# Altium schematic sheet MINI-STM32.SchDoc
size A3
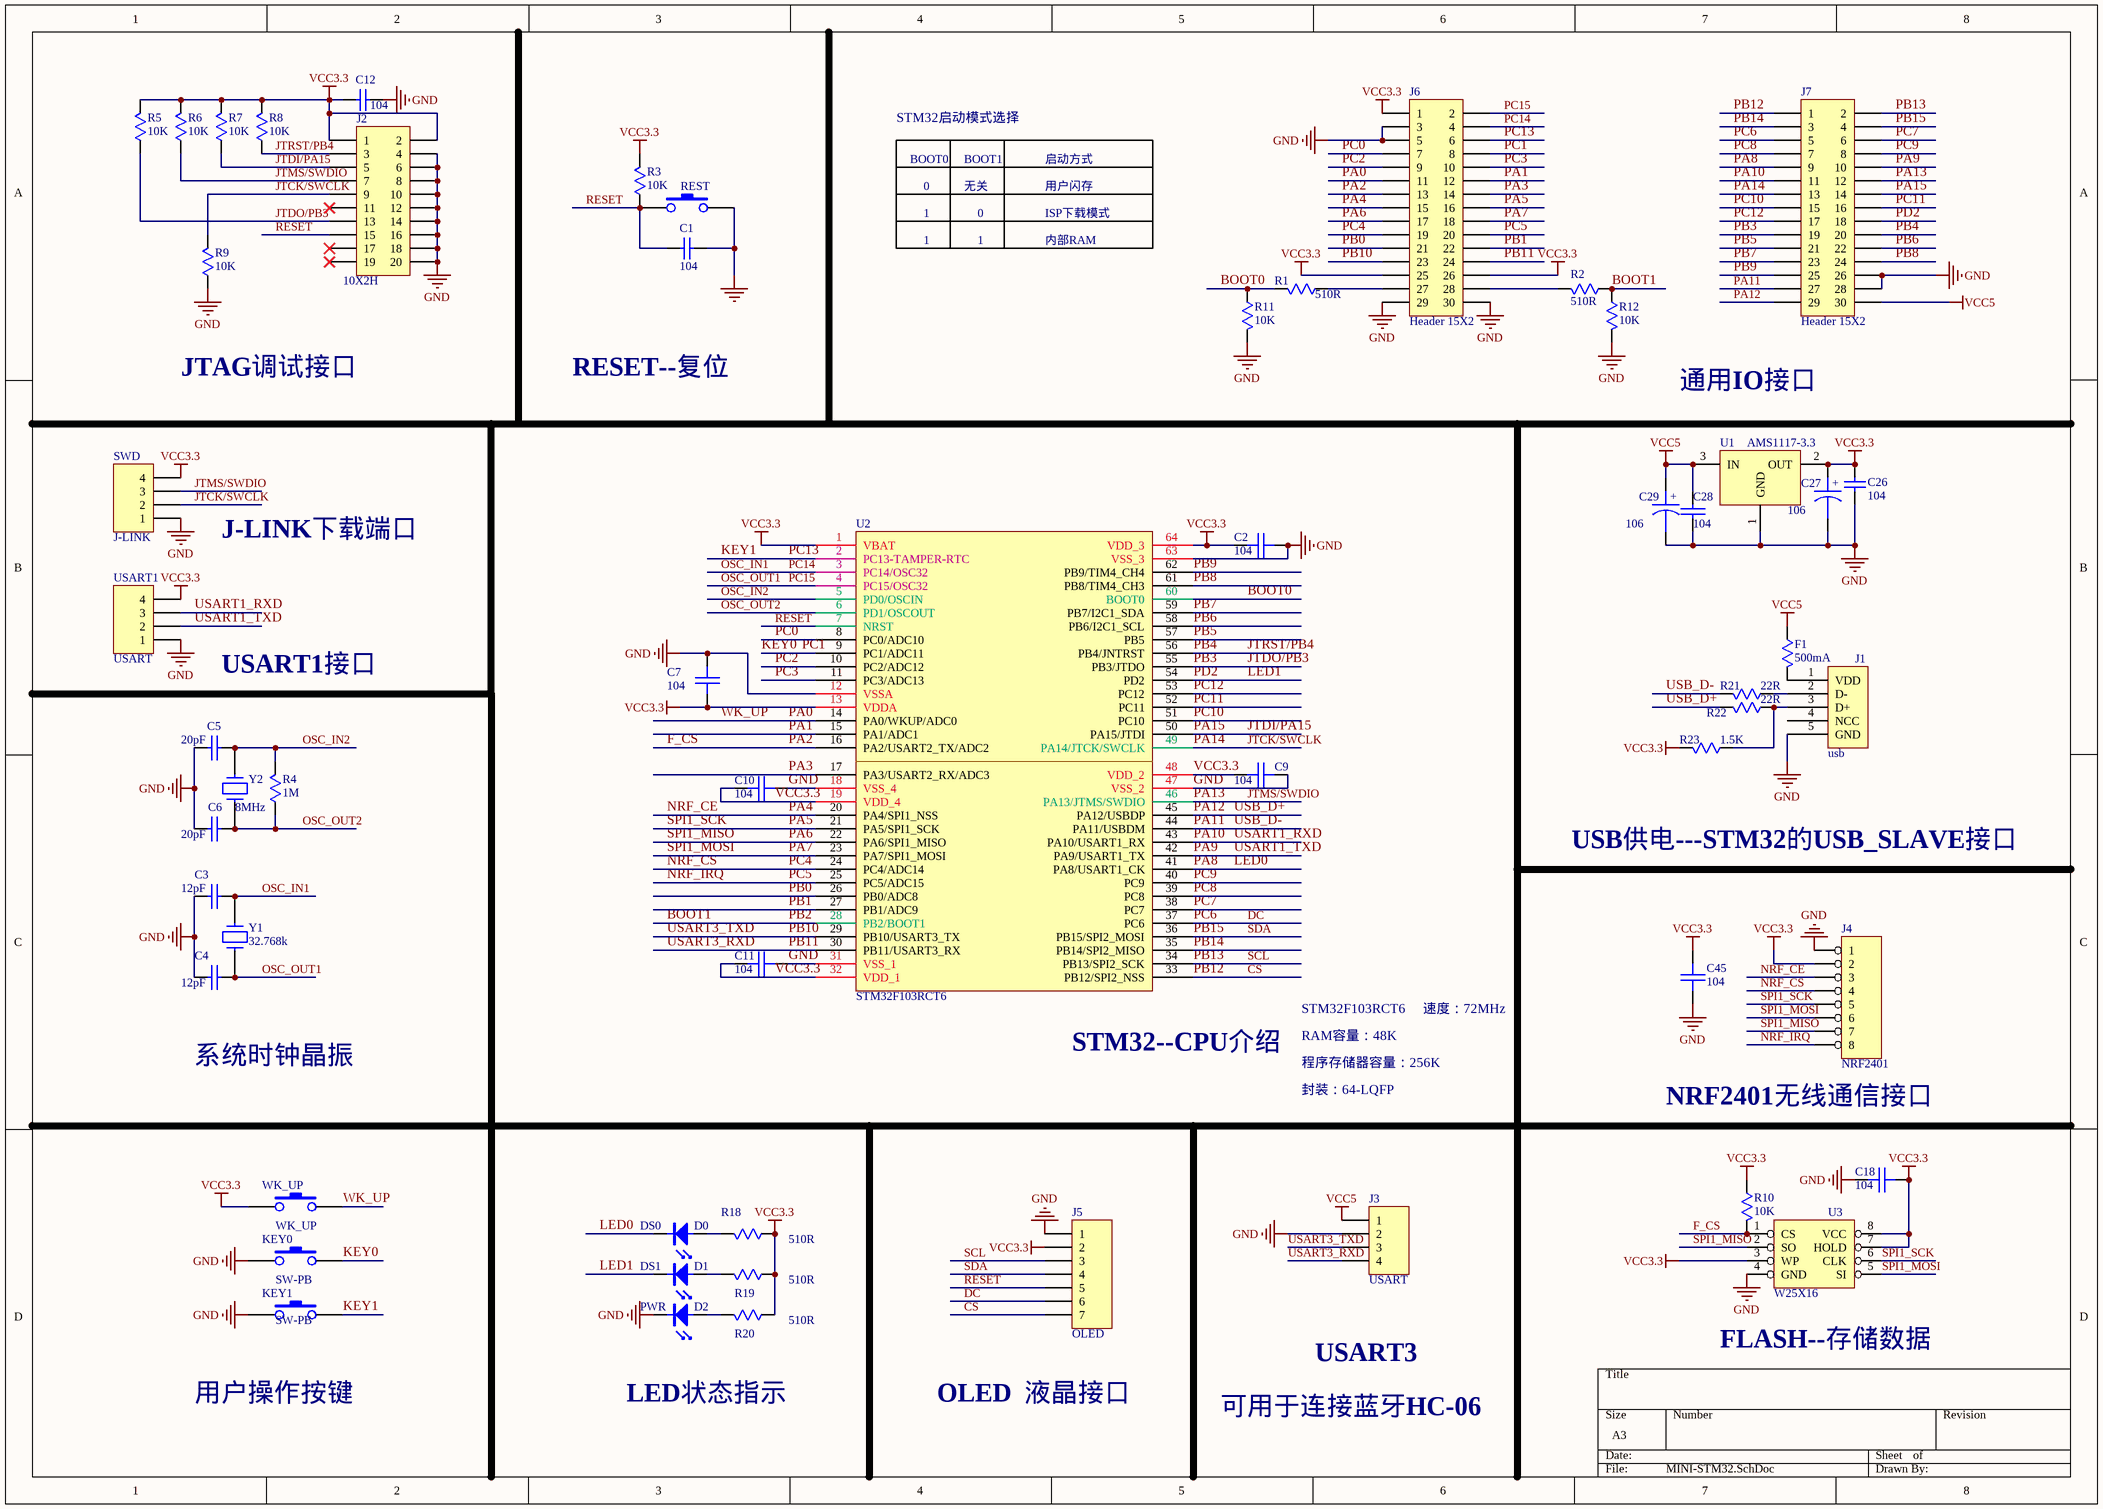
[diagram p0: MINI-STM32.SchDoc]

## Parts
C1  104  [0603C]
C2  104  [0603J]
C3  12pF  [0603J]
C4  12pF  [0603J]
C5  20pF  [0603J]
C6  20pF  [0603J]
C7  104  [0603J]
C9  104  [0603J]
C10  104  [0603J]
C11  104  [0603J]
C12  104  [0603C]
C18  104  [0603J]
C26  104  [0603J]
C27  106  [TAC_3216]
C28  104  [0603J]
C29  106  [TAC_3216]
C45  104  [0603J]
D0  DS0  [LED_0603(B)]
D1  DS1  [LED_0603(B)]
D2  PWR  [LED_0603(B)]
F1  500mA  [RC0805]
J1  usb  [mini_USB]
J2  10X2H  [IDC20]
J3  USART  [HDR1X4]
J4  NRF2401  [HDR2X4]
J5  OLED  [HDR1X7]
J6  Header 15X2  [IDE15X2_2.54]
J7  Header 15X2  [IDE15X2_2.54]
KEY0  SW-PB  [micro button_2_SMD]
KEY1  SW-PB  [micro button_2_SMD]
R1  510R  [0603J]
R2  510R  [0603J]
R3  10K  [0603J]
R4  1M  [0603J]
R5  10K  [0603J]
R6  10K  [0603J]
R7  10K  [0603J]
R8  10K  [0603J]
R9  10K  [0603J]
R10  10K  [0603J]
R11  10K  [0603J]
R12  10K  [0603J]
R18  510R  [0603J]
R19  510R  [0603J]
R20  510R  [0603J]
R21  22R  [0603J]
R22  22R  [0603J]
R23  1.5K  [0603J]
REST  (no value)  [micro button_2_SMD]
SWD  J-LINK  [HDR1X4]
U1  AMS1117-3.3  [SOT223]
U2  STM32F103RCT6  [LQFP64]
U3  W25X16  [SOIC8P]
USART1  USART  [HDR1X4]
WK_UP  WK_UP  [micro button_2_SMD]
Y1  32.768k  [32.768k]
Y2  8MHz  [smt-xtal]

## Nets
GND: C1.1 C2.2 C3.1 C4.1 C5.1 C6.1 C7.1 C9.2 C10.2 C11.2 C12.2 C18.1 C26.2 C27.2 C28.2 C29.2 C45.2 D2.2 J1.5(GND) J2.4 J2.6 J2.8 J2.10 J2.12 J2.14 J2.16 J2.18 J2.20 J3.2 J4.1 J5.1 J6.3 J6.5 J6.29 J6.30 J7.26 J7.28 KEY0.1 KEY1.1 R9.1 R11.2 R12.2 REST.2 SWD.1 U1.1(GND) U2.12(VSSA) U2.18(VSS_4) U2.31(VSS_1) U2.47(VSS_2) U2.63(VSS_3) U3.4(GND) USART1.1
VCC3.3: C2.1 C7.2 C9.1 C10.1 C11.1 C12.1 C18.2 C26.1 C27.1 C45.1 J2.1 J2.2 J4.2 J5.2 J6.1 J6.25 J6.26 R3.2 R5.2 R6.2 R7.2 R8.2 R10.1 R18.1 R19.1 R20.1 R23.2 SWD.4 U1.2(OUT) U2.1(VBAT) U2.13(VDDA) U2.19(VDD_4) U2.32(VDD_1) U2.48(VDD_2) U2.64(VDD_3) U3.3(WP) U3.7(HOLD) U3.8(VCC) USART1.4 WK_UP.1
VCC5: C28.1 C29.1 F1.1 J3.1 J7.30 U1.3(IN)
BOOT0: R1.2 R11.1 U2.60(BOOT0)
BOOT1: R2.1 R12.1 U2.28(PB2/BOOT1)  [also labelled PB2]
CS: J5.7 J7.1 U2.33(PB12/SPI2_NSS)  [also labelled PB12]
DC: J5.6 J7.5 U2.37(PC6)  [also labelled PC6]
F_CS: J6.13 R10.2 U2.16(PA2/USART2_TX/ADC2) U3.1(CS)  [also labelled PA2]
JTCK/SWCLK: J2.9 J7.13 R9.2 SWD.2 U2.49(PA14/JTCK/SWCLK)  [also labelled PA14]
JTDI/PA15: J2.5 J7.14 R7.1 U2.50(PA15/JTDI)  [also labelled PA15]
JTDO/PB3: J2.13 J7.19 R5.1 U2.55(PB3/JTDO)  [also labelled PB3]
JTMS/SWDIO: J2.7 J7.12 R6.1 SWD.3 U2.46(PA13/JTMS/SWDIO)  [also labelled PA13]
JTRST/PB4: J2.3 J7.20 R8.1 U2.56(PB4/JNTRST)  [also labelled PB4]
KEY0: J6.8 KEY0.2 U2.9(PC1/ADC11)  [also labelled PC1]
KEY1: J6.6 KEY1.2 U2.2(PC13-TAMPER-RTC)  [also labelled PC13]
LED0: D0.2 J7.9 U2.41(PA8/USART1_CK)  [also labelled PA8]
LED1: D1.2 J7.18 U2.54(PD2)  [also labelled PD2]
NRF_CE: J4.3 J6.15 U2.20(PA4/SPI1_NSS)  [also labelled PA4]
NRF_CS: J4.4 J6.19 U2.24(PC4/ADC14)  [also labelled PC4]
NRF_IRQ: J4.8 J6.20 U2.25(PC5/ADC15)  [also labelled PC5]
OSC_IN1: C3.2 J6.4 U2.3(PC14/OSC32) Y1.2  [also labelled PC14]
OSC_IN2: C5.2 R4.2 U2.5(PD0/OSCIN) Y2.1
OSC_OUT1: C4.2 J6.2 U2.4(PC15/OSC32) Y1.1  [also labelled PC15]
OSC_OUT2: C6.2 R4.1 U2.6(PD1/OSCOUT) Y2.2
PA0: J6.11 U2.14(PA0/WKUP/ADC0) WK_UP.2  [also labelled WK_UP]
PA1: J6.12 U2.15(PA1/ADC1)
PA3: J6.14 U2.17(PA3/USART2_RX/ADC3)
PA5: J4.5 J6.16 U2.21(PA5/SPI1_SCK) U3.6(CLK)  [also labelled SPI1_SCK]
PA6: J4.7 J6.17 U2.22(PA6/SPI1_MISO) U3.2(SO)  [also labelled SPI1_MISO]
PA7: J4.6 J6.18 U2.23(PA7/SPI1_MOSI) U3.5(SI)  [also labelled SPI1_MOSI]
PA9: J7.10 U2.42(PA9/USART1_TX) USART1.2  [also labelled USART1_TXD]
PA10: J7.11 U2.43(PA10/USART1_RX) USART1.3  [also labelled USART1_RXD]
PA11: J7.27 R21.2 U2.44(PA11/USBDM)  [also labelled USB_D-]
PA12: J7.29 R22.2 U2.45(PA12/USBDP)  [also labelled USB_D+]
PB0: J6.21 U2.26(PB0/ADC8)
PB1: J6.22 U2.27(PB1/ADC9)
PB5: J7.21 U2.57(PB5)
PB6: J7.22 U2.58(PB6/I2C1_SCL)
PB7: J7.23 U2.59(PB7/I2C1_SDA)
PB8: J7.24 U2.61(PB8/TIM4_CH3)
PB9: J7.25 U2.62(PB9/TIM4_CH4)
PB10: J3.3 J6.23 U2.29(PB10/USART3_TX)  [also labelled USART3_TXD]
PB11: J3.4 J6.24 U2.30(PB11/USART3_RX)  [also labelled USART3_RXD]
PB13: J5.3 J7.2 U2.34(PB13/SPI2_SCK)  [also labelled SCL]
PB14: J7.3 U2.35(PB14/SPI2_MISO)
PB15: J5.4 J7.4 U2.36(PB15/SPI2_MOSI)  [also labelled SDA]
PC0: J6.7 U2.8(PC0/ADC10)
PC2: J6.9 U2.10(PC2/ADC12)
PC3: J6.10 U2.11(PC3/ADC13)
PC7: J7.6 U2.38(PC7)
PC8: J7.7 U2.39(PC8)
PC9: J7.8 U2.40(PC9)
PC10: J7.15 U2.51(PC10)
PC11: J7.16 U2.52(PC11)
PC12: J7.17 U2.53(PC12)
RESET: C1.2 J2.15 J5.5 R3.1 REST.1 U2.7(NRST)
NetD0_1: D0.1 R18.2
NetD1_1: D1.1 R19.2
NetD2_1: D2.1 R20.2
NetF1_2: F1.2 J1.1(VDD)
NetJ1_2: J1.2(D-) R21.1
NetJ1_3: J1.3(D+) R22.1 R23.1
NetJ6_27: J6.27 R1.1
NetJ6_28: J6.28 R2.2

Not connected (* = marked no-connect by the designer): J1 4(NCC); J2 11* 17* 19*

## Notes on the sheet
- STM32启动模式选择
- BOOT0
- BOOT1
- 启动方式
- 0
- 1
- 无关
- 用户闪存
- ISP下载模式
- 内部RAM
- JTAG调试接口
- RESET--复位
- 通用IO接口
- J-LINK下载端口
- USART1接口
- USB供电---STM32的USB_SLAVE接口
- (near U2) STM32--CPU介绍
- STM32F103RCT6
- RAM容量：48K
- 速度：72MHz
- 系统时钟晶振
- 程序存储器容量：256K
- 封装：64-LQFP
- (near J4) NRF2401无线通信接口
- USART3
- (near U3) FLASH--存储数据
- 用户操作按键
- LED状态指示
- OLED  液晶接口
- 可用于连接蓝牙HC-06
- (in symbol CAPACITOR POL) +

## Library data of the parts
C1 C12 = CAP: GRM39 X7R102K50PT; Value: 100pF; Published: 8-Jun-2000; Revision: July-2002: Re-released for DXP Platform.; Publisher: Altium Limited; REF: GRM39 X7R102K50PT
C2 C7 C9-C11 C18 C45 = CAP
C3 C4 = CAP: CAP CHIP 20P 50V(+-5% C0G 0603); Value: 20pF
C5 C6 = CAP: CAP CHIP 20P 50V(+-5% C0G 0603); Value: 20pF
C26 = Cap: Capacitor; Published: 8-Jun-2000; LatestRevisionDate: 17-Jul-2002; LatestRevisionNote: Re-released for DXP Platform.; PackageReference: RAD-0.3; Publisher: Altium Limited
C27 C29 = CAPACITOR POL: Capacitor
C28 = CAP: Capacitor
D0-D2 = LED
F1 R1-R12 R18-R23 = RES
J2 = Header 10X2H: Header, 10-Pin, Dual row, Right Angle; LatestRevisionDate: 17-Jul-2002; LatestRevisionNote: Re-released for DXP Platform.; Publisher: Altium Limited
J3 SWD USART1 = Header 4: Header, 4-Pin; LatestRevisionDate: 17-Jul-2002; LatestRevisionNote: Re-released for DXP Platform.; Publisher: Altium Limited
J4 = HEADER 8: 8 Pin Header
J5 = Header 7: Header, 7-Pin; LatestRevisionDate: 17-Jul-2002; LatestRevisionNote: Re-released for DXP Platform.; Publisher: Altium Limited
J6 J7 = Header 15X2: Header, 15-Pin, Dual row; LatestRevisionDate: 17-Jul-2002; LatestRevisionNote: Re-released for DXP Platform.; Publisher: Altium Limited
REST WK_UP = SW-PB
U1 = LT1085CM-3.3
U2 = STM32F103RBT6
Y1 Y2 = CRYSTAL: Crystal 8MHz PLUG; Value: 8MHz